# EAGLE design macro_fader (EAGLE 9.6.2)
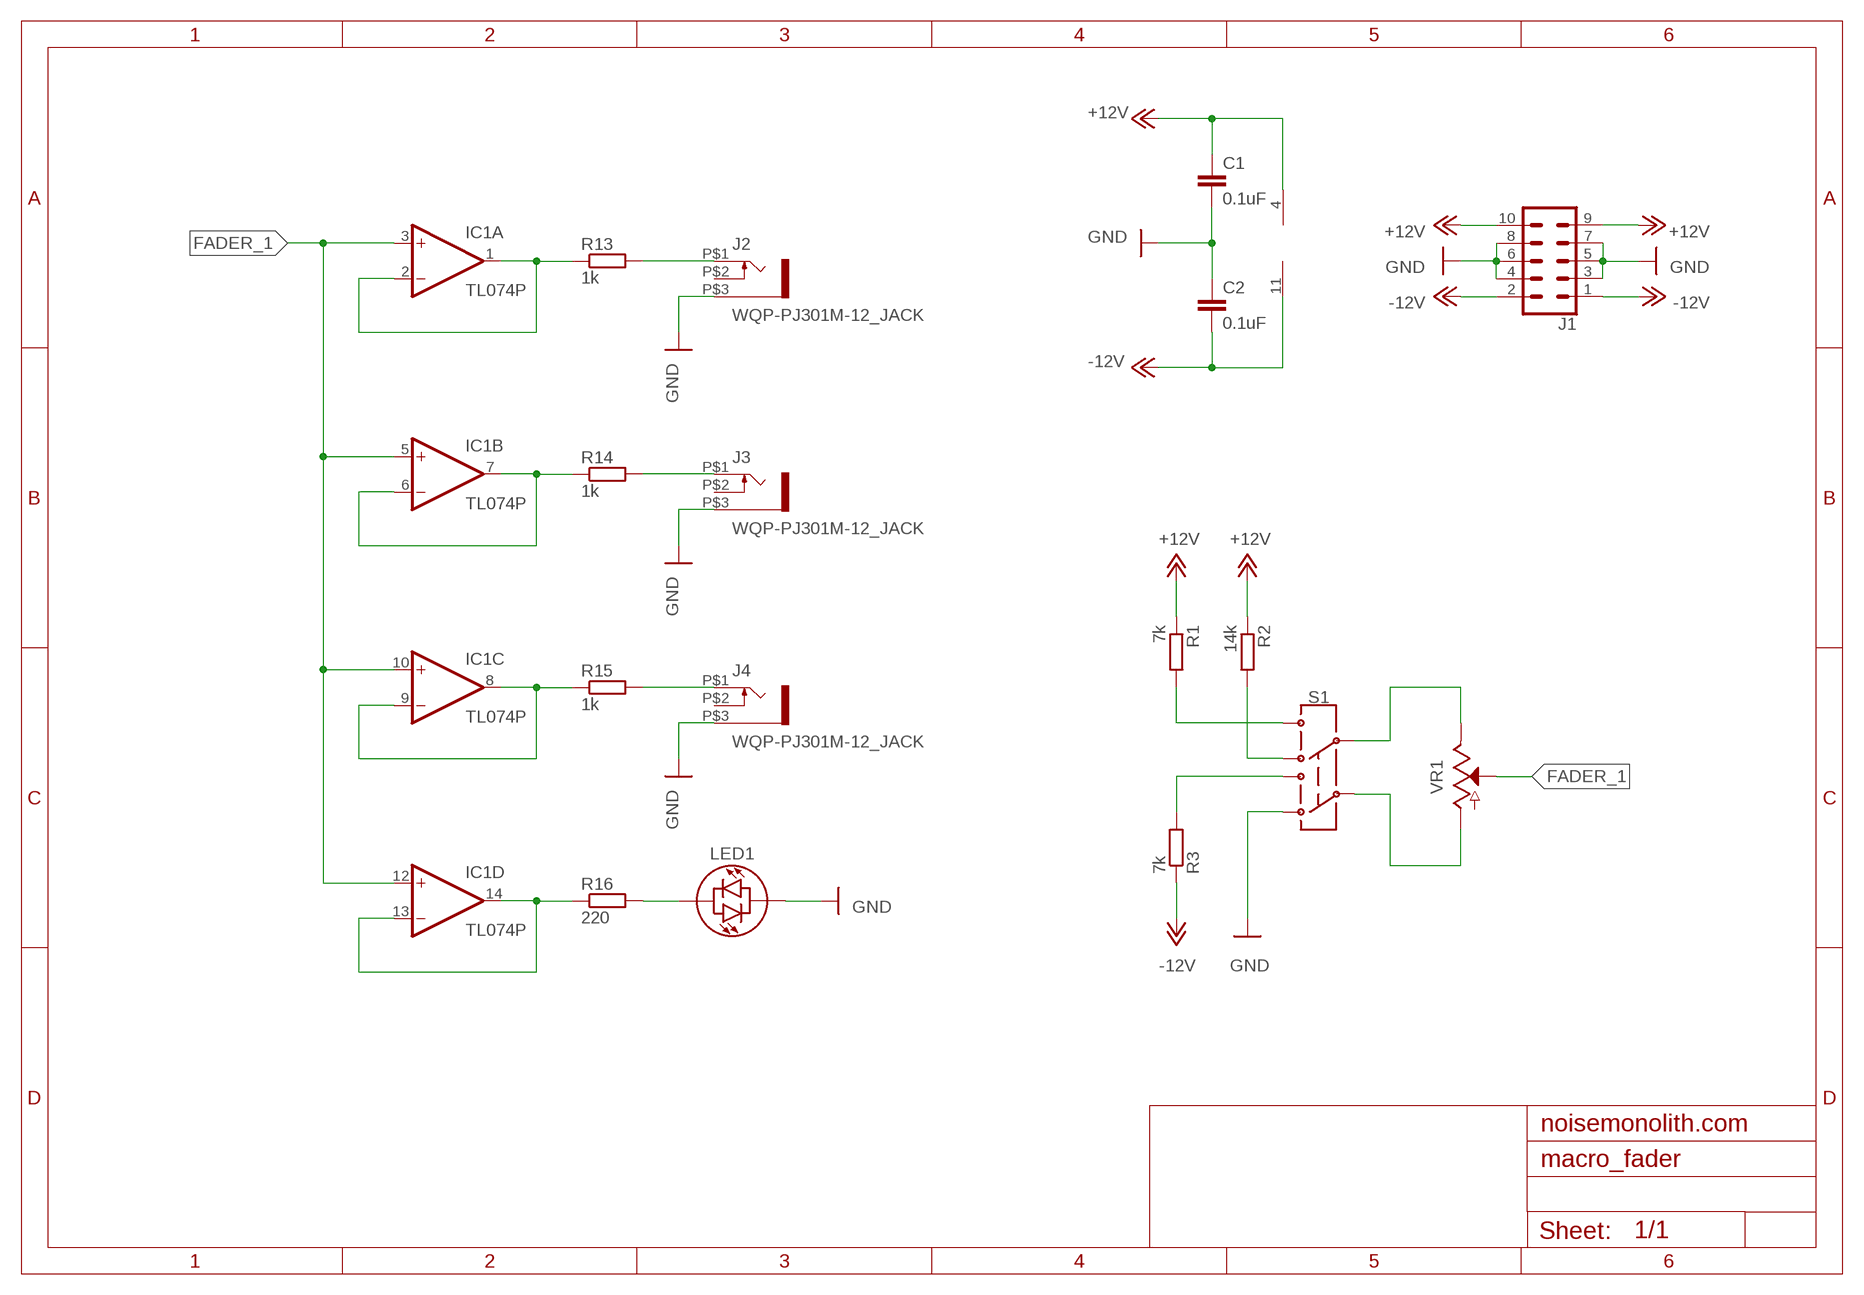
[diagram p0: schematic, sheet 1]

## Parts
C1  0.1uF  C-EU050-025X075  [C050-025X075]
C2  0.1uF  C-EU050-025X075  [C050-025X075]
IC1  TL074P  [DIL14]
J1  CONN_05X2SHD  [2X5-SHROUDED]
J2  WQP-PJ301M-12_JACK  [WQP-PJ301M-12_JACK]
J3  WQP-PJ301M-12_JACK  [WQP-PJ301M-12_JACK]
J4  WQP-PJ301M-12_JACK  [WQP-PJ301M-12_JACK]
LED1  A-1076_RED-GREEN-LED-3MM3MM  [A-1076_RED-GREEN-LED-3MM]
R1  7k  R-EU_0207/7  [0207/7]
R2  14k  R-EU_0207/7  [0207/7]
R3  7k  R-EU_0207/7  [0207/7]
R13  1k  R-EU_0207/7  [0207/7]
R14  1k  R-EU_0207/7  [0207/7]
R15  1k  R-EU_0207/7  [0207/7]
R16  220  R-EU_0207/7  [0207/7]
S1  A-4568_MINITOGGLESWITCH_DPDT_ON-ON  [A-4568_MINITOGGLESWITCH_DPDT_ON-ON]
VR1  F4505-N0SC2B10K  [F4505-N0SC2B10K]

## Nets
+12V: C1.1 IC1.4(P:V+) J1.9 J1.10 R1.1 R2.1
-12V: C2.2 IC1.11(P:V-) J1.1 J1.2 R3.1
FADER_1: IC1.3(A:+IN) IC1.5(B:+IN) IC1.10(C:+IN) IC1.12(D:+IN) VR1.2
GND: C1.2 C2.1 J1.3 J1.4 J1.5 J1.6 J1.7 J1.8 J2.P$3 J3.P$3 J4.P$3 LED1.G(GREEN) S1.6
N$1: S1.2 VR1.1
N$2: S1.5 VR1.3
N$3: R1.2 S1.1
N$4: IC1.1(A:OUT) IC1.2(A:-IN) R13.1
N$5: R2.2 S1.3
N$6: J2.P$1 R13.2
N$7: R3.2 S1.4
N$9: IC1.6(B:-IN) IC1.7(B:OUT) R14.1
N$10: J3.P$1 R14.2
N$11: IC1.8(C:OUT) IC1.9(C:-IN) R15.1
N$12: J4.P$1 R15.2
N$13: IC1.13(D:-IN) IC1.14(D:OUT) R16.1
N$14: LED1.R(RED) R16.2
Unconnected: J2.P$2 J3.P$2 J4.P$2

## Notes on the sheet
- noisemonolith.com

## Library data of the parts
C1 C2 = rcl:C-EU: CAPACITOR, European symbol; SPICEPREFIX: C
IC1 = linear:TL074: OP AMP
J1 = SparkFun-Connectors:CONN_05X2: Multi connection point. Often used as Generic Header-pin footprint for 0.1 inch spaced/style header connections For AVR SPI programming port, see special device with nice symbol: "AVR_SPI_PROG_5x2.dev" You can populate with any combo of single row headers, but if you'd like an exact match, check these: 2x5 AVR ICSP Male Header <https://www.sparkfun.com/products/778> (PRT-00778) 2x5 Pin Shrouded Header <https://www.sparkfun.com/products/8506> (PRT-08506) On any of the 0.1 inch spaced packages, you can populate with these: Break Away Headers - Straight <https://www.sparkfun.com/products/116> (PRT-00116) Break Away Male Headers - Right Angle <https://www.sparkfun.com/products/553> (PRT-00553) Female Headers <https://www.sparkfun.com/products/115> (PRT-00115) Break Away Headers - Machine Pin <https://www.sparkfun.com/products/117> (PRT-00117) Break Away Female Headers - Swiss Machine Pin <https://www.sparkfun.com/products/743> (PRT-00743) Special note: the shrouded connector mates well with our 5x2 ribbon cables: 2x5 Pin IDC Ribbon Cable <https://www.sparkfun.com/products/8535> (PRT-08535); PROD_ID: CONN-08671; SF_ID: PRT-08506
J2-J4 = thonkiconn:WQP-PJ301M-12_JACK
LED1 = custom_parts:A-1076_RED-GREEN-LED-3MM
R1-R3 R13-R16 = resistor:R-EU_: RESISTOR, European symbol
S1 = custom_parts:A-4568_MINITOGGLESWITCH_DPDT_ON-ON
VR1 = custom_parts:F4505-N0SC2B10K: TRU COMPONENTS F4505-N0SC2B10K

## Board
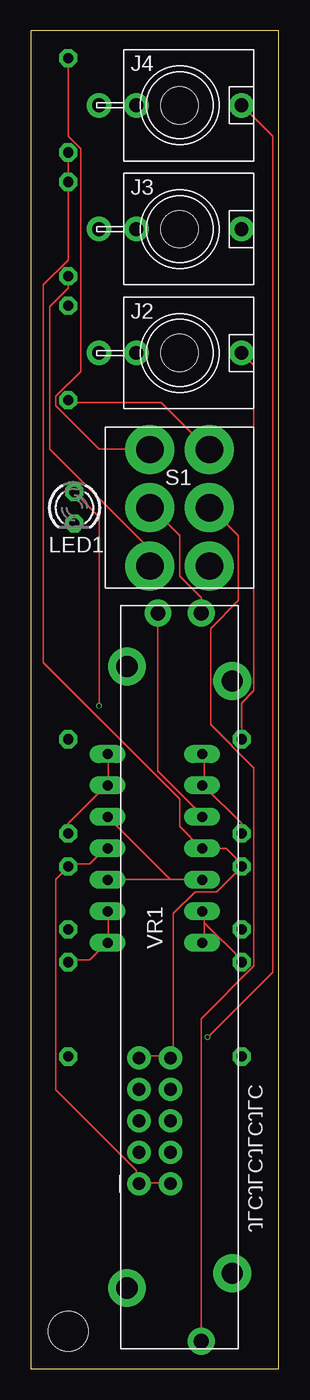
[diagram p1: board, top side]
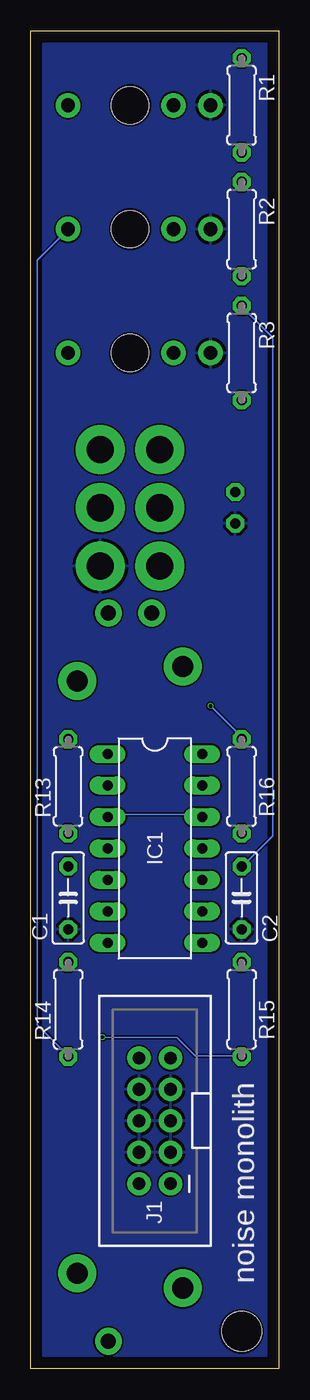
[diagram p2: board, bottom side, seen from below]

Size 20 x 108 mm. Coordinates in mm from the lower left corner, seen from the top.
Outline: 0,0 20,0 20,108 0,108 0,0
Copper layers (1*16): Top 0.035mm / dielectric 1.6mm / Bottom 0.035mm
Design rules "jlcpcb-2layers": minimum track width 5mil, minimum drill 0.3mm, track to track 5mil, track to pad 5mil, pad to pad 5mil, via to via 5mil, smd to smd 5mil, copper to edge 0.2mm, drill to drill 6mil, minimum pad ring 10mil, minimum via ring 3mil, stop-mask expansion 4mil, vias tented up to drill 0mil, thermal gap 10mil
Holes 3.2 mm at 3,3
Holes 3 mm at 12,82 12,92 12,102

### Footprints (pad centres in the part's own frame; a part is rotated, then mirrored left to right if it is on the bottom)
C050-025X075 = drill 0.813 octagon: 1 -2.54,0; 2 2.54,0
DIL14 = drill 0.813 long: 1 -7.62,-3.81; 2 -5.08,-3.81; 3 -2.54,-3.81; 4 0,-3.81; 5 2.54,-3.81; 6 5.08,-3.81; 7 7.62,-3.81; 8 7.62,3.81; 9 5.08,3.81; 10 2.54,3.81; 11 0,3.81; 12 -2.54,3.81; 13 -5.08,3.81; 14 -7.62,3.81
2X5-SHROUDED = drill 1.016 pad 1.88: 1 -1.27,5.08; 2 1.27,5.08; 3 -1.27,2.54; 4 1.27,2.54; 5 -1.27,0; 6 1.27,0; 7 -1.27,-2.54; 8 1.27,-2.54; 9 -1.27,-5.08; 10 1.27,-5.08
WQP-PJ301M-12_JACK = drill 1.1: P$1 0,5; P$2 0,-3.5; P$3 0,-6.5
A-1076_RED-GREEN-LED-3MM = drill 0.813 octagon: G 1.27,0; R -1.27,0
0207/7 = drill 0.813 octagon: 1 -3.81,0; 2 3.81,0
A-4568_MINITOGGLESWITCH_DPDT_ON-ON = drill 2.2: 1 -2.4,4.7; 2 -2.4,0; 3 -2.4,-4.7; 4 2.4,4.7; 5 2.4,0; 6 2.4,-4.7
F4505-N0SC2B10K = drill 1.2 pad 1.8: 1 0,1.75; 2 0,-1.75; 3 58.8,1.75 | drill 1.7 pad 2.55: MH1 5.5,4.25; MH2 4.3,-4.25; MH3 53.3,4.25; MH4 54.5,-4.25

### Placement (x,y rotation side)
C1  17,38 270 bottom
C2  3,38 90 bottom
IC1  10,42 270 bottom
J1  10,20 180 bottom
J2  12,82 270 top
J3  12,92 270 top
J4  12,102 270 top
LED1  3.5,69.5 270 top
R1  3,102 90 bottom
R2  3,92 270 bottom
R3  3,82 270 bottom
R13  17,47 90 bottom
R14  17,29 270 bottom
R15  3,29 270 bottom
R16  3,47 90 bottom
S1  12,69.5 0 top
VR1  12,61 270 top

### Tracks (layer width: path | path; a pad name or v marks a point on that pad's centre or on a via)
+12V
  Top 0.127: J1.9 8.75,25.25 11.25,25.25 J1.10 11.5,25.25 11.5,36.75 13.25,38.5 15,38.5 17,40.5 C1.1 17,40.75 15.75,42 IC1.4 13.75,42 12,43.75 12,46 1,57 1,87.5 3,89.5 R2.1 R1.1
-12V
  Top 0.127: J1.2 11.25,15 8.75,15 J1.1 8.5,15 8.5,16 2,22.5 2,39.5 3,40.5 C2.2 3,40.75 4.75,40.75 6,42 IC1.11
  Bottom 0.127: R3.1 3,85.75 0.5,83.25 0.5,43 3,40.5 C2.2
FADER_1
  Top 0.127: 11.25,39.5 13.75,39.5 IC1.5 | 11.25,39.5 6.25,39.5 IC1.10 | 11.25,39.5 6.25,44.5 IC1.12 | VR1.2 10.25,48.25 13.75,44.75 IC1.3
  Bottom 0.127: IC1.3 13.75,44.75 6.25,44.75 IC1.12
GND
  pour Bottom: 1,1 19,1 19,107 1,107
N$1
  Top 0.127: VR1.1 13.75,62.25 12,64 12,67.25 9.75,69.5 S1.2
N$2
  Top 0.127: VR1.3 13.75,28.25 18,32.5 18,48.5 14.5,52 14.5,59.75 16.75,62 16.75,67.25 14.5,69.5 S1.5
N$3
  Top 0.127: R1.2 3,99.5 4,98.5 4,80.5 2,78.5 2,77.75 5.5,74.25 9.5,74.25 S1.1
N$4
  Top 0.127: R13.1 17,44 14,47 IC1.2 14,47.25 14,49.5 IC1.1
N$5
  Top 0.127: R2.2 3,87.25 1.5,85.75 1.5,74.25 9.5,66.25 9.5,65 S1.3
N$6
  Top 0.127: R13.2 17,53.75 18,54.75 18,81 J2.P$1
N$7
  Top 0.127: R3.2 3,78 10.5,78 14.25,74.25 S1.4
N$9
  Top 0.127: 14,36 14,36.75 IC1.6 | 14,36 14,34.5 IC1.7 | 14,36 17,33 R14.1
N$10
  Bottom 0.127: J3.P$1 19.5,89.5 19.5,27.75 17,25.25 R14.2
N$11
  Top 0.127: R15.1 3,33 4.75,33 6,34.25 IC1.8 6.25,34.5 6.25,36.75 IC1.9
N$12  (via drill 0.3)
  Top 0.127: v14.25,26.75 19.5,32 19.5,99.5 J4.P$1
  Bottom 0.127: v14.25,26.75 8.25,26.75 6.75,25.25 3,25.25 R15.2
N$13
  Top 0.127: R16.1 3,44 6,47 IC1.13 6.25,47.25 6.25,49.5 IC1.14
N$14  (via drill 0.3)
  Top 0.127: v5.5,53.5 5.5,68.75 3.5,70.75 LED1.R
  Bottom 0.127: v5.5,53.5 3,51 R16.2

### Text on the board
tPlace: JLCJLCJLCJLC
bPlace: noise monolith